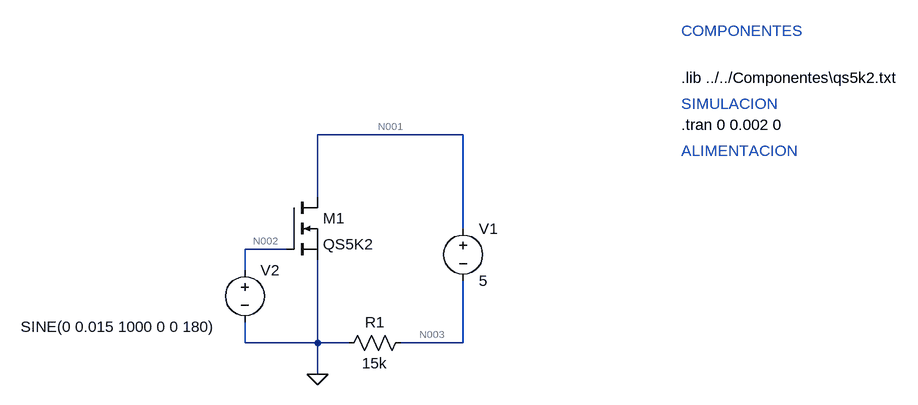
[diagram p0: schematic simulacion.asc]
simulacion.asc, the LTspice schematic file:
Version 4
SHEET 1 1252 872
WIRE 64 -80 -160 -80
WIRE -160 16 -160 -80
WIRE 64 64 64 -80
WIRE -208 96 -272 96
WIRE -272 128 -272 96
WIRE -272 240 -272 208
WIRE -160 240 -160 112
WIRE -160 240 -272 240
WIRE -112 240 -160 240
WIRE 64 240 64 144
WIRE 64 240 -32 240
WIRE -160 288 -160 240
FLAG -160 288 0
SYMBOL voltage 64 48 R0
WINDOW 123 0 0 Left 2
WINDOW 39 0 0 Left 2
SYMATTR InstName V1
SYMATTR Value 5
SYMBOL voltage -272 112 R0
WINDOW 3 -345 103 Left 2
WINDOW 123 0 0 Left 2
WINDOW 39 63 46 Left 2
SYMATTR Value SINE(0 0.015 1000 0 0 180)
SYMATTR InstName V2
SYMBOL nmos -208 16 R0
SYMATTR InstName M1
SYMATTR Value QS5K2
SYMATTR Prefix X
SYMBOL res -16 224 R90
WINDOW 0 0 56 VBottom 2
WINDOW 3 32 56 VTop 2
SYMATTR InstName R1
SYMATTR Value 15k
TEXT 400 -96 Left 2 !.tran 0 0.002 0
TEXT 400 -168 Left 2 !.lib ../../Componentes\\qs5k2.txt
TEXT 400 -240 Left 2 ;COMPONENTES
TEXT 400 -128 Left 2 ;SIMULACION
TEXT 400 -56 Left 2 ;ALIMENTACION

The netlist it stands for:
* simulacion.asc
V1 N001 N003 5
V2 N002 0 SINE(0 0.015 1000 0 0 180)
XM1 N001 N002 0 QS5K2  ; pins D G S
R1 N003 0 15k
.tran 0 0.002 0
.lib ../../Componentes\qs5k2.txt
* COMPONENTES
* SIMULACION
* ALIMENTACION
.backanno
.end

* Results of the author's LTspice run, read from the files saved beside the schematic
* Operating Point, zero values left out:
*   V(n001) = 4.998 V
*   V(n003) = -2.5 mV
*   I(R1) = -166.7 nA
*   I(V2) = 4.998 pA
*   I(V1) = -166.7 nA
*   Ix(m1:1) = 166.7 nA
*   Ix(m1:2) = -4.998 pA
*   Ix(m1:3) = -166.7 nA
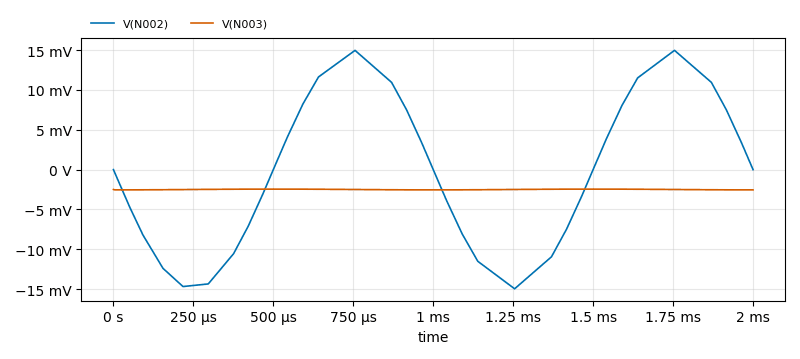
[diagram p1: Transient Analysis of simulacion.asc, plotted from the saved traces]
* Transient Analysis, 1 run:
*   V(N002): min -14.97 mV, max 14.97 mV, average -39.31 µV, rms 10.38 mV, last 0 V
*   V(N003): min -2.555 mV, max -2.451 mV, average -2.5 mV, rms 2.5 mV, last -2.549 mV